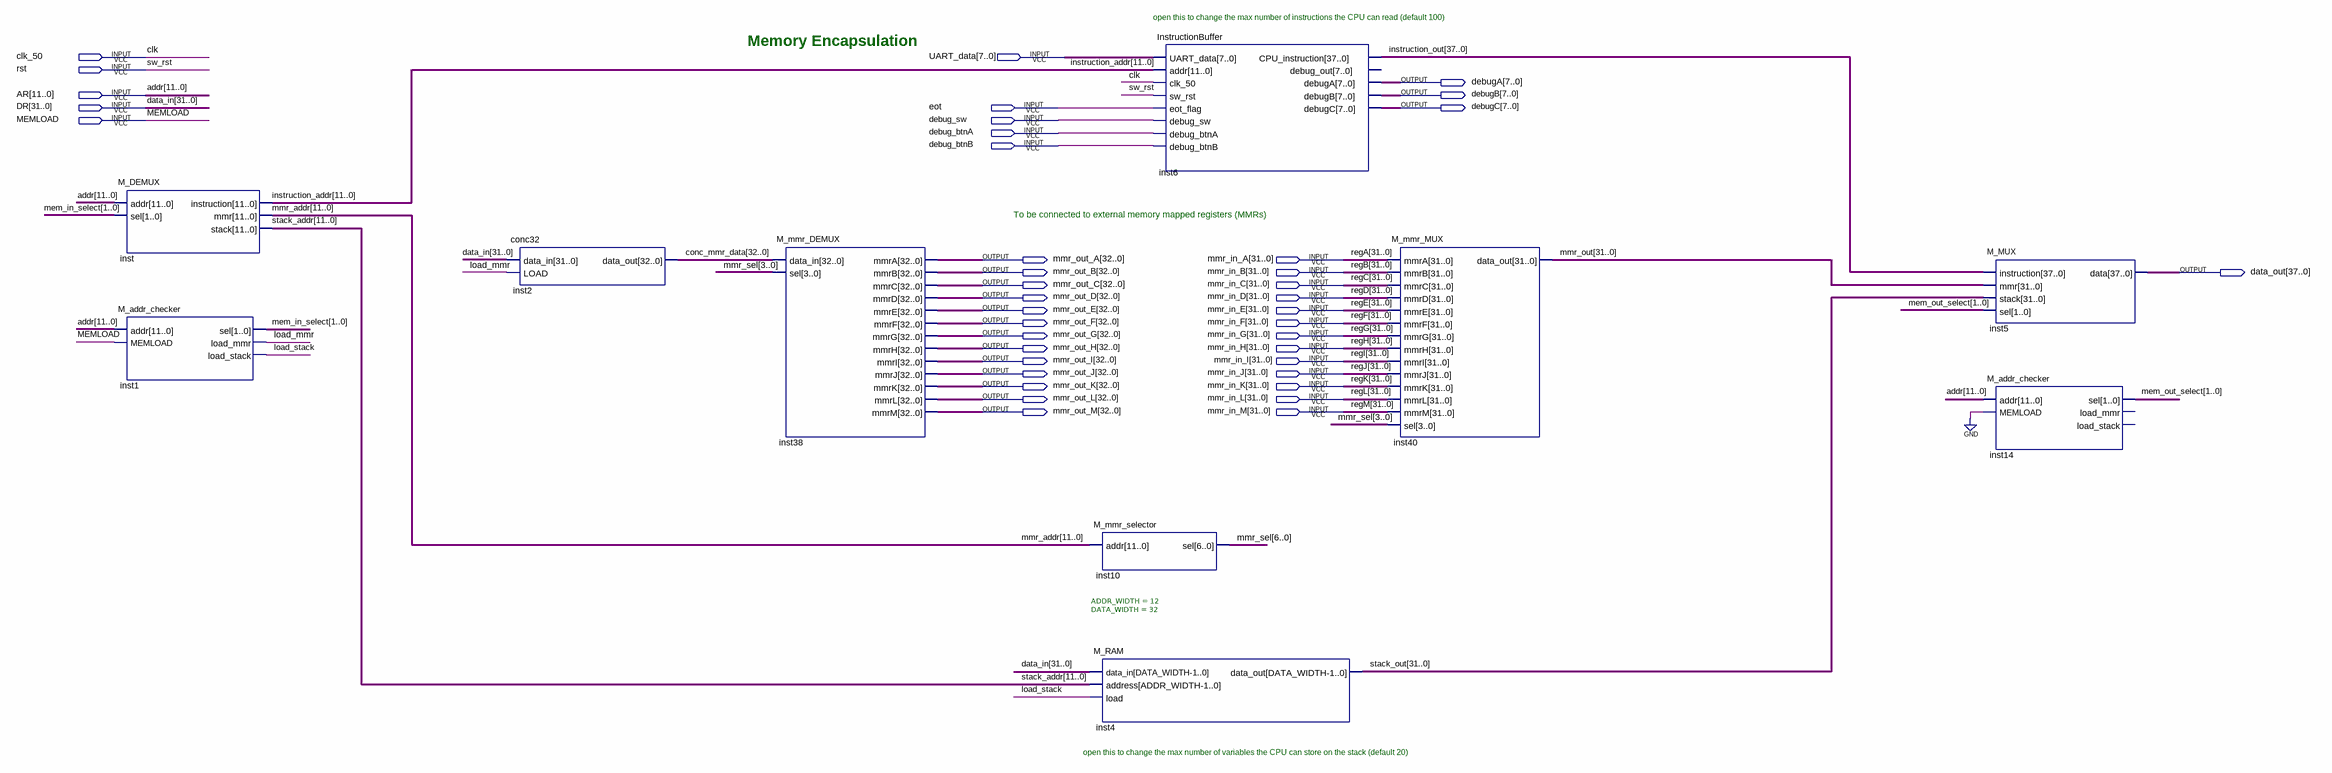
[diagram p0: schematic sheet]
// Quartus schematic Memory.bdf as structural Verilog: 10 symbols, 40 pins
module Memory (
  input  clk_50,
  input  [7:0] UART_data,
  input  rst,
  input  [11:0] AR,
  input  [31:0] DR,
  input  eot,
  input  MEMLOAD,
  input  debug_sw,
  input  debug_btnA,
  input  debug_btnB,
  input  [31:0] mmr_in_A,
  input  [31:0] mmr_in_B,
  input  [31:0] mmr_in_C,
  input  [31:0] mmr_in_D,
  input  [31:0] mmr_in_E,
  input  [31:0] mmr_in_F,
  input  [31:0] mmr_in_G,
  input  [31:0] mmr_in_H,
  input  [31:0] mmr_in_I,
  input  [31:0] mmr_in_J,
  input  [31:0] mmr_in_K,
  input  [31:0] mmr_in_L,
  input  [31:0] mmr_in_M,
  output [7:0] debugA,
  output [7:0] debugB,
  output [7:0] debugC,
  output [32:0] mmr_out_A,
  output [32:0] mmr_out_B,
  output [37:0] data_out,
  output [32:0] mmr_out_C,
  output [32:0] mmr_out_D,
  output [32:0] mmr_out_E,
  output [32:0] mmr_out_F,
  output [32:0] mmr_out_G,
  output [32:0] mmr_out_H,
  output [32:0] mmr_out_I,
  output [32:0] mmr_out_J,
  output [32:0] mmr_out_K,
  output [32:0] mmr_out_L,
  output [32:0] mmr_out_M
);

  wire load_mmr, load_stack;
  wire [1:0] mem_in_select, mem_out_select;
  wire [6:0] mmr_sel;
  wire [11:0] instruction_addr, mmr_addr, stack_addr;
  wire [31:0] mmr_out, stack_out;
  wire [32:0] conc_mmr_data;
  wire [37:0] instruction_out;

  M_DEMUX inst (.addr(AR), .sel(mem_in_select), .instruction(instruction_addr), .mmr(mmr_addr), .stack(stack_addr));
  M_addr_checker inst1 (
    .addr(AR), .MEMLOAD(MEMLOAD), .sel(mem_in_select), .load_mmr(load_mmr), .load_stack(load_stack));
  conc32 inst2 (.data_in(DR), .LOAD(load_mmr), .data_out(conc_mmr_data));
  M_mmr_DEMUX inst38 (
    .data_in(conc_mmr_data), .sel(mmr_sel[3:0]), .mmrA(mmr_out_A), .mmrB(mmr_out_B), .mmrC(mmr_out_C),
    .mmrD(mmr_out_D), .mmrE(mmr_out_E), .mmrF(mmr_out_F), .mmrG(mmr_out_G), .mmrH(mmr_out_H),
    .mmrI(mmr_out_I), .mmrJ(mmr_out_J), .mmrK(mmr_out_K), .mmrL(mmr_out_L), .mmrM(mmr_out_M));
  M_mmr_selector inst10 (.addr(mmr_addr), .sel(mmr_sel));
  M_RAM #(.ADDR_WIDTH(12), .DATA_WIDTH(32)) inst4 (
    .data_in(DR), .address(stack_addr), .load(load_stack), .data_out(stack_out));
  InstructionBuffer inst6 (
    .UART_data(UART_data), .addr(instruction_addr), .clk_50(clk_50), .sw_rst(rst), .eot_flag(eot),
    .debug_sw(debug_sw), .debug_btnA(debug_btnA), .debug_btnB(debug_btnB), .CPU_instruction(instruction_out),
    .debugA(debugA), .debugB(debugB), .debugC(debugC));  // open: debug_out
  M_mmr_MUX inst40 (
    .mmrA(mmr_in_A), .mmrB(mmr_in_B), .mmrC(mmr_in_C), .mmrD(mmr_in_D), .mmrE(mmr_in_E), .mmrF(mmr_in_F),
    .mmrG(mmr_in_G), .mmrH(mmr_in_H), .mmrI(mmr_in_I), .mmrJ(mmr_in_J), .mmrK(mmr_in_K), .mmrL(mmr_in_L),
    .mmrM(mmr_in_M), .sel(mmr_sel[3:0]), .data_out(mmr_out));
  M_MUX inst5 (.instruction(instruction_out), .mmr(mmr_out), .stack(stack_out), .sel(mem_out_select), .data(data_out));
  M_addr_checker inst14 (.addr(AR), .MEMLOAD(1'b0), .sel(mem_out_select));  // open: load_mmr, load_stack

  // Other names for the same wires on the sheet: addr[11:0] = AR; clk = clk_50; data_in[31:0] = DR;
  //   regA[31:0] = mmr_in_A; regB[31:0] = mmr_in_B; regC[31:0] = mmr_in_C; regD[31:0] = mmr_in_D;
  //   regE[31:0] = mmr_in_E; regF[31:0] = mmr_in_F; regG[31:0] = mmr_in_G; regH[31:0] = mmr_in_H;
  //   regI[31:0] = mmr_in_I; regJ[31:0] = mmr_in_J; regK[31:0] = mmr_in_K; regL[31:0] = mmr_in_L;
  //   regM[31:0] = mmr_in_M; sw_rst = rst

  // Notes on the sheet:
  //   open this to change the max number of instructions the CPU can read (default 100)
  //   Memory Encapsulation
  //   To be connected to external memory mapped registers (MMRs)
  //   open this to change the max number of variables the CPU can store on the stack (default 20)
endmodule
